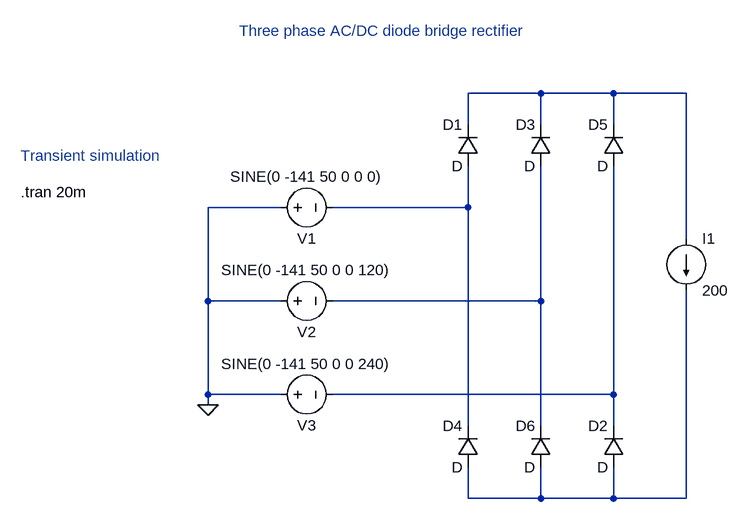
[diagram p0: schematic Three-phase-rectifier.asc]
Three-phase-rectifier.asc, the LTspice schematic file:
Version 4
SHEET 1 932 680
WIRE 224 -80 112 -80
WIRE 336 -80 224 -80
WIRE 448 -80 336 -80
WIRE 112 -32 112 -80
WIRE 224 -32 224 -80
WIRE 336 -32 336 -80
WIRE -176 96 -288 96
WIRE 112 96 112 32
WIRE 112 96 -96 96
WIRE 448 144 448 -80
WIRE -288 240 -288 96
WIRE -176 240 -288 240
WIRE 224 240 224 32
WIRE 224 240 -96 240
WIRE -288 384 -288 240
WIRE -176 384 -288 384
WIRE 336 384 336 32
WIRE 336 384 -96 384
WIRE -288 400 -288 384
WIRE 112 432 112 96
WIRE 224 432 224 240
WIRE 336 432 336 384
WIRE 112 544 112 496
WIRE 224 544 224 496
WIRE 224 544 112 544
WIRE 336 544 336 496
WIRE 336 544 224 544
WIRE 448 544 448 224
WIRE 448 544 336 544
FLAG -288 400 0
SYMBOL voltage -192 96 R270
WINDOW 0 -32 56 VBottom 2
WINDOW 3 32 56 VTop 2
WINDOW 123 0 0 Left 0
WINDOW 39 0 0 Left 0
SYMATTR InstName V1
SYMATTR Value SINE(0 -141 50 0 0 0)
SYMBOL voltage -192 240 R270
WINDOW 0 -32 56 VBottom 2
WINDOW 3 32 56 VTop 2
WINDOW 123 0 0 Left 0
WINDOW 39 0 0 Left 0
SYMATTR InstName V2
SYMATTR Value SINE(0 -141 50 0 0 120)
SYMBOL voltage -192 384 R270
WINDOW 0 -32 56 VBottom 2
WINDOW 3 32 56 VTop 2
WINDOW 123 0 0 Left 0
WINDOW 39 0 0 Left 0
SYMATTR InstName V3
SYMATTR Value SINE(0 -141 50 0 0 240)
SYMBOL diode 128 32 R180
WINDOW 0 24 64 Left 2
WINDOW 3 24 0 Left 2
SYMATTR InstName D1
SYMBOL diode 352 496 R180
WINDOW 0 24 64 Left 2
WINDOW 3 24 0 Left 2
SYMATTR InstName D2
SYMBOL diode 240 32 R180
WINDOW 0 24 64 Left 2
WINDOW 3 24 0 Left 2
SYMATTR InstName D3
SYMBOL diode 128 496 R180
WINDOW 0 24 64 Left 2
WINDOW 3 24 0 Left 2
SYMATTR InstName D4
SYMBOL diode 352 32 R180
WINDOW 0 24 64 Left 2
WINDOW 3 24 0 Left 2
SYMATTR InstName D5
SYMBOL diode 240 496 R180
WINDOW 0 24 64 Left 2
WINDOW 3 24 0 Left 2
SYMATTR InstName D6
SYMBOL current 448 144 R0
WINDOW 123 0 0 Left 0
WINDOW 39 0 0 Left 0
SYMATTR InstName I1
SYMATTR Value 200
TEXT -576 72 Left 2 !.tran 20m
TEXT -240 -176 Left 2 ;Three phase AC/DC diode bridge rectifier
TEXT -576 16 Left 2 ;Transient simulation

The netlist it stands for:
* Three-phase-rectifier.asc
V1 0 N002 SINE(0 -141 50 0 0 0)
V2 0 N003 SINE(0 -141 50 0 0 120)
V3 0 N004 SINE(0 -141 50 0 0 240)
D1 N002 N001 D
D2 N005 N004 D
D3 N003 N001 D
D4 N005 N002 D
D5 N004 N001 D
D6 N005 N003 D
I1 N001 N005 200
.model D D
.lib standard.dio
.tran 20m
* Three phase AC/DC diode bridge rectifier
* Transient simulation
.backanno
.end